# Altium schematic sheet GPS.SchDoc
size A4
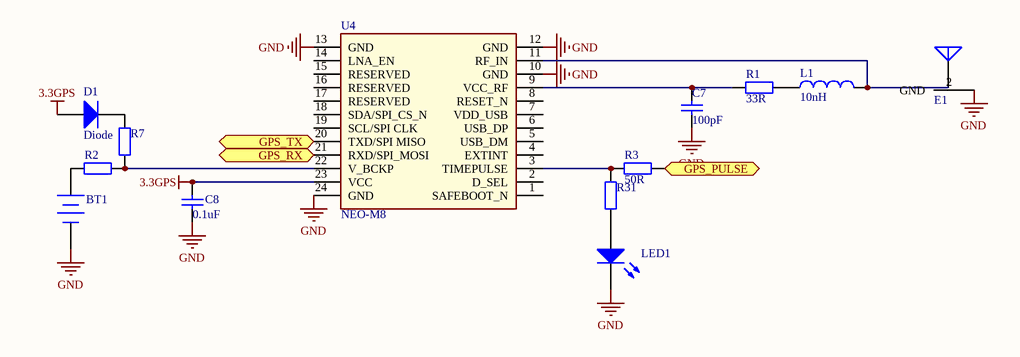
[diagram p0: GPS.SchDoc]

## Parts
BT1  Battery  [XH414H-IV01E]  (value not drawn)
C7  100pF  [0402]
C8  0.1uF  [0402]
D1  Diode  [LC-SOD-323]
E1  Antenna  [IPEX]  (value not drawn)
L1  10nH  [0402]
LED1  LED0  [0603]  (value not drawn)
R1  33R  [0402]
R2  (no value)  [0402]
R3  50R  [0402]
R7  (no value)  [0402]
R31  (no value)  [0402]
U4  NEO-M8  [NEO]

## Ports
GPS_PULSE, GPS_RX, GPS_TX

## Nets
3.3GPS: C8.2 D1.1(A) U4.23(VCC)
GND: BT1.2(-) C7.1 C8.1 E1.2(GND) LED1.2(K) U4.10(GND) U4.12(GND) U4.13(GND) U4.24(GND)
GPS_PULSE: R3.1 ; port GPS_PULSE
GPS_RX: U4.21(RXD/SPI_MOSI) ; port GPS_RX
GPS_TX: U4.20(TXD/SPI_MISO) ; port GPS_TX
NetBT1_1: BT1.1(+) R2.1
NetC7_2: C7.2 R1.1 U4.9(VCC_RF)
NetD1_2: D1.2(K) R7.1
NetE1_1: E1.1(ANT) L1.2 U4.11(RF_IN)
NetL1_1: L1.1 R1.2
NetLED1_1: LED1.1(A) R31.2
NetR2_2: R2.2 R7.2 U4.22(V_BCKP)
NetR3_2: R3.2 R31.1 U4.3(TIMEPULSE)

Not connected (* = marked no-connect by the designer): U4 1(SAFEBOOT_N) 2(D_SEL) 4(EXTINT) 5(USB_DM) 6(USB_DP) 7(VDD_USB) 8(RESET_N) 14(LNA_EN) 15(RESERVED) 16(RESERVED) 17(RESERVED) 18(SDA/SPI_CS_N) 19(SCL/SPI_CLK)

## Library data of the parts
BT1 = Battery: Multicell Battery; Published: 24-Mar-1999; LatestRevisionDate: 17-Jul-2002; LatestRevisionNote: Re-released for DXP Platform.; PackageReference: BAT-2; Publisher: Altium Limited; PackageDescription: Battery; 2 Leads
C7 C8 = Cap: Capacitor; Published: 8-Jun-2000; LatestRevisionDate: 17-Jul-2002; LatestRevisionNote: Re-released for DXP Platform.; PackageReference: RAD-0.3; Publisher: Altium Limited; PackageDescription: Radial Cap, Thru-Hole; 2 Leads; 0.3 in Pin Spacing
D1 = Diode: Default Diode; Published: 8-Jun-2000; LatestRevisionDate: 17-Jul-2002; LatestRevisionNote: Re-released for DXP Platform.; PackageVersion: Sep-1996; PackageReference: SMC; Publisher: Altium Limited; PackageDescription: DO-214-AB/SMC; 2 C-Bend Leads; Body 7.9 x 5.9 mm, inc. leads (LxW); Code_JEDEC: DO-214-AB
E1 = Antenna: Generic Antenna; Published: 24-Mar-1999; LatestRevisionDate: 17-Jul-2002; LatestRevisionNote: Re-released for DXP Platform.; PackageReference: PIN1; Publisher: Altium Limited
L1 = Inductor: Code_IEC: 1005; Value: 10mH; Published: 8-Jun-2000; LatestRevisionDate: 29-May-2009; LatestRevisionNote: IPC-7351 Footprint Added.; PackageReference: 0402-A; Publisher: Altium Limited; PackageDescription: Chip Inductor; Code_JEITA: 0402
LED1 = LED0: Typical INFRARED GaAs LED; Published: 8-Jun-2000; LatestRevisionDate: 08-Jul-2005; LatestRevisionNote: Mech Layer 1 removed.; PackageReference: LED-0; Publisher: Altium Limited; PackageDescription: LED; 2 Leads
R1 R3 = Res2: Resistor; Published: 8-Jun-2000; LatestRevisionDate: 17-Jul-2002; LatestRevisionNote: Re-released for DXP Platform.; PackageReference: AXIAL-0.4; Publisher: Altium Limited; PackageDescription: Axial Device, Thru-Hole; 2 Leads; 0.4 in Pin Spacing
R2 R7 R31 = Res2: Resistor; Value: 0R; Published: 8-Jun-2000; LatestRevisionDate: 17-Jul-2002; LatestRevisionNote: Re-released for DXP Platform.; PackageReference: AXIAL-0.4; Publisher: Altium Limited; PackageDescription: Axial Device, Thru-Hole; 2 Leads; 0.4 in Pin Spacing
U4 = NEO: u-blox NEO GNSS module; Part Description: u-blox GNSS module; Manufacturer: u-blox; Value: NEO-M8